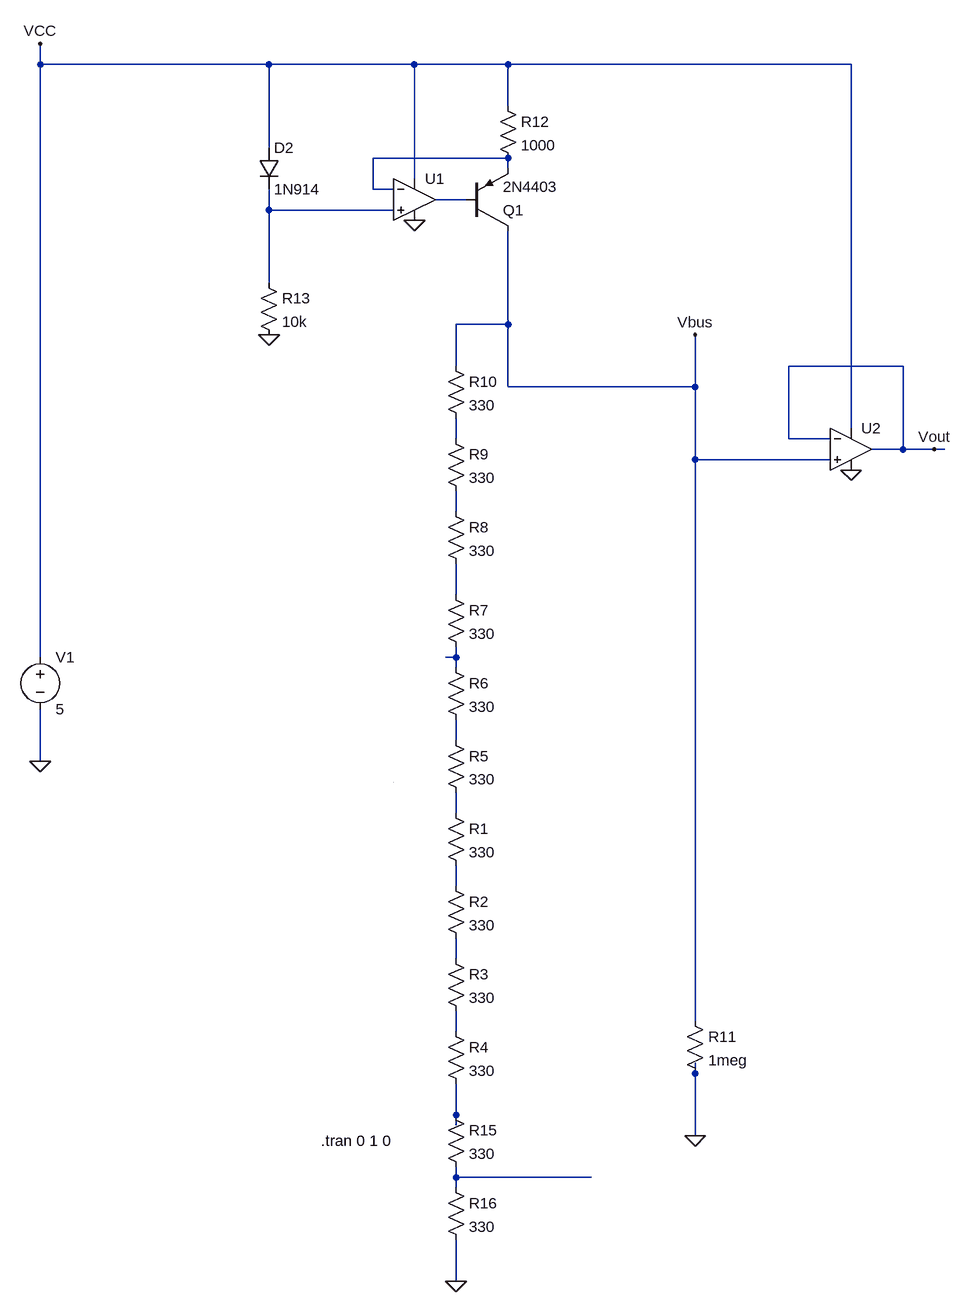
[diagram p0: schematic VKey.asc]
VKey.asc, the LTspice schematic file:
Version 4
SHEET 1 1068 788
WIRE -544 -1104 -544 -1136
WIRE -192 -1104 -544 -1104
WIRE 32 -1104 -192 -1104
WIRE 176 -1104 32 -1104
WIRE 704 -1104 176 -1104
WIRE 176 -1040 176 -1104
WIRE -192 -976 -192 -1104
WIRE 176 -960 -32 -960
WIRE 176 -944 176 -960
WIRE 32 -928 32 -1104
WIRE -32 -912 -32 -960
WIRE 0 -912 -32 -912
WIRE 112 -896 64 -896
WIRE -192 -880 -192 -912
WIRE 0 -880 -192 -880
WIRE -192 -768 -192 -880
WIRE 176 -704 176 -848
WIRE 176 -704 96 -704
WIRE 96 -640 96 -704
WIRE 784 -640 608 -640
WIRE 176 -608 176 -704
WIRE 464 -608 464 -688
WIRE 464 -608 176 -608
WIRE 704 -544 704 -1104
WIRE 96 -528 96 -560
WIRE 608 -528 608 -640
WIRE 672 -528 608 -528
WIRE 784 -512 784 -640
WIRE 784 -512 736 -512
WIRE 832 -512 784 -512
WIRE 848 -512 832 -512
WIRE 464 -496 464 -608
WIRE 672 -496 464 -496
WIRE 96 -416 96 -448
WIRE 96 -288 96 -336
WIRE -544 -192 -544 -1104
WIRE 96 -192 96 -208
WIRE 96 -192 80 -192
WIRE 96 -176 96 -192
WIRE 96 -64 96 -96
WIRE -544 -32 -544 -112
WIRE 96 48 96 16
WIRE 96 160 96 128
WIRE 96 272 96 240
WIRE 464 368 464 -496
WIRE 96 384 96 352
WIRE 464 448 464 432
WIRE 464 544 464 448
WIRE 96 512 96 464
WIRE 96 528 96 512
WIRE 96 608 96 592
WIRE 304 608 96 608
WIRE 96 624 96 608
WIRE 96 768 96 704
WIRE 0 0 0 0
FLAG -544 -32 0
FLAG -544 -1136 VCC
FLAG 464 -688 Vbus
FLAG 464 544 0
FLAG -192 -688 0
FLAG 96 768 0
FLAG 832 -512 Vout
FLAG 32 -864 0
FLAG 704 -480 0
SYMBOL res 80 32 R0
SYMATTR InstName R1
SYMATTR Value 330
SYMBOL res 80 144 R0
SYMATTR InstName R2
SYMATTR Value 330
SYMBOL res 80 256 R0
SYMATTR InstName R3
SYMATTR Value 330
SYMBOL res 80 368 R0
SYMATTR InstName R4
SYMATTR Value 330
SYMBOL res 80 -80 R0
SYMATTR InstName R5
SYMATTR Value 330
SYMBOL res 80 -192 R0
SYMATTR InstName R6
SYMATTR Value 330
SYMBOL res 80 -304 R0
SYMATTR InstName R7
SYMATTR Value 330
SYMBOL voltage -544 -208 R0
WINDOW 123 0 0 Left 2
WINDOW 39 0 0 Left 2
SYMATTR InstName V1
SYMATTR Value 5
SYMBOL res 80 -432 R0
SYMATTR InstName R8
SYMATTR Value 330
SYMBOL res 80 -544 R0
SYMATTR InstName R9
SYMATTR Value 330
SYMBOL res 80 -656 R0
SYMATTR InstName R10
SYMATTR Value 330
SYMBOL res 448 352 R0
SYMATTR InstName R11
SYMATTR Value 1meg
SYMBOL diode -208 -976 R0
SYMATTR InstName D2
SYMATTR Value 1N914
SYMBOL res -208 -784 R0
SYMATTR InstName R13
SYMATTR Value 10k
SYMBOL res 80 496 R0
SYMATTR InstName R15
SYMATTR Value 330
SYMBOL res 80 608 R0
SYMATTR InstName R16
SYMATTR Value 330
SYMBOL pnp 112 -848 M180
SYMATTR InstName Q1
SYMATTR Value 2N4403
SYMBOL Opamps\\UniversalOpamp2 32 -896 R0
SYMATTR InstName U1
SYMBOL res 160 -1056 R0
SYMATTR InstName R12
SYMATTR Value 1000
SYMBOL Opamps\\UniversalOpamp2 704 -512 R0
SYMATTR InstName U2
TEXT -112 552 Left 2 !.tran 0 1 0

The netlist it stands for:
* VKey.asc
R1 N009 N010 330
R2 N010 N011 330
R3 N011 N012 330
R4 N012 N013 330
R5 N008 N009 330
R6 N007 N008 330
R7 N006 N007 330
V1 VCC 0 5
R8 N005 N006 330
R9 N004 N005 330
R10 Vbus N004 330
R11 Vbus 0 1meg
D2 VCC N003 1N914
R13 N003 0 10k
R15 N013 N014 330
R16 N014 0 330
Q1 Vbus N002 N001 0 2N4403
XU1 N003 N001 VCC 0 N002 level.2 Avol=1Meg GBW=10Meg Slew=10Meg ilimit=25m rail=0 Vos=0 phimargin=45 en=0 enk=0 in=0 ink=0 Rin=500Meg  ; pins IN+ IN- V+ V- OUT
R12 VCC N001 1000
XU2 Vbus Vout VCC 0 Vout level.2 Avol=1Meg GBW=10Meg Slew=10Meg ilimit=25m rail=0 Vos=0 phimargin=45 en=0 enk=0 in=0 ink=0 Rin=500Meg  ; pins IN+ IN- V+ V- OUT
.model D D
.lib standard.dio
.model NPN NPN
.model PNP PNP
.lib standard.bjt
.tran 0 1 0
.lib UniversalOpamps2.sub
.backanno
.end